# EAGLE schematic VentaConnected_Arduino_V0.01_2017-10-21 (EAGLE 8.3.2)
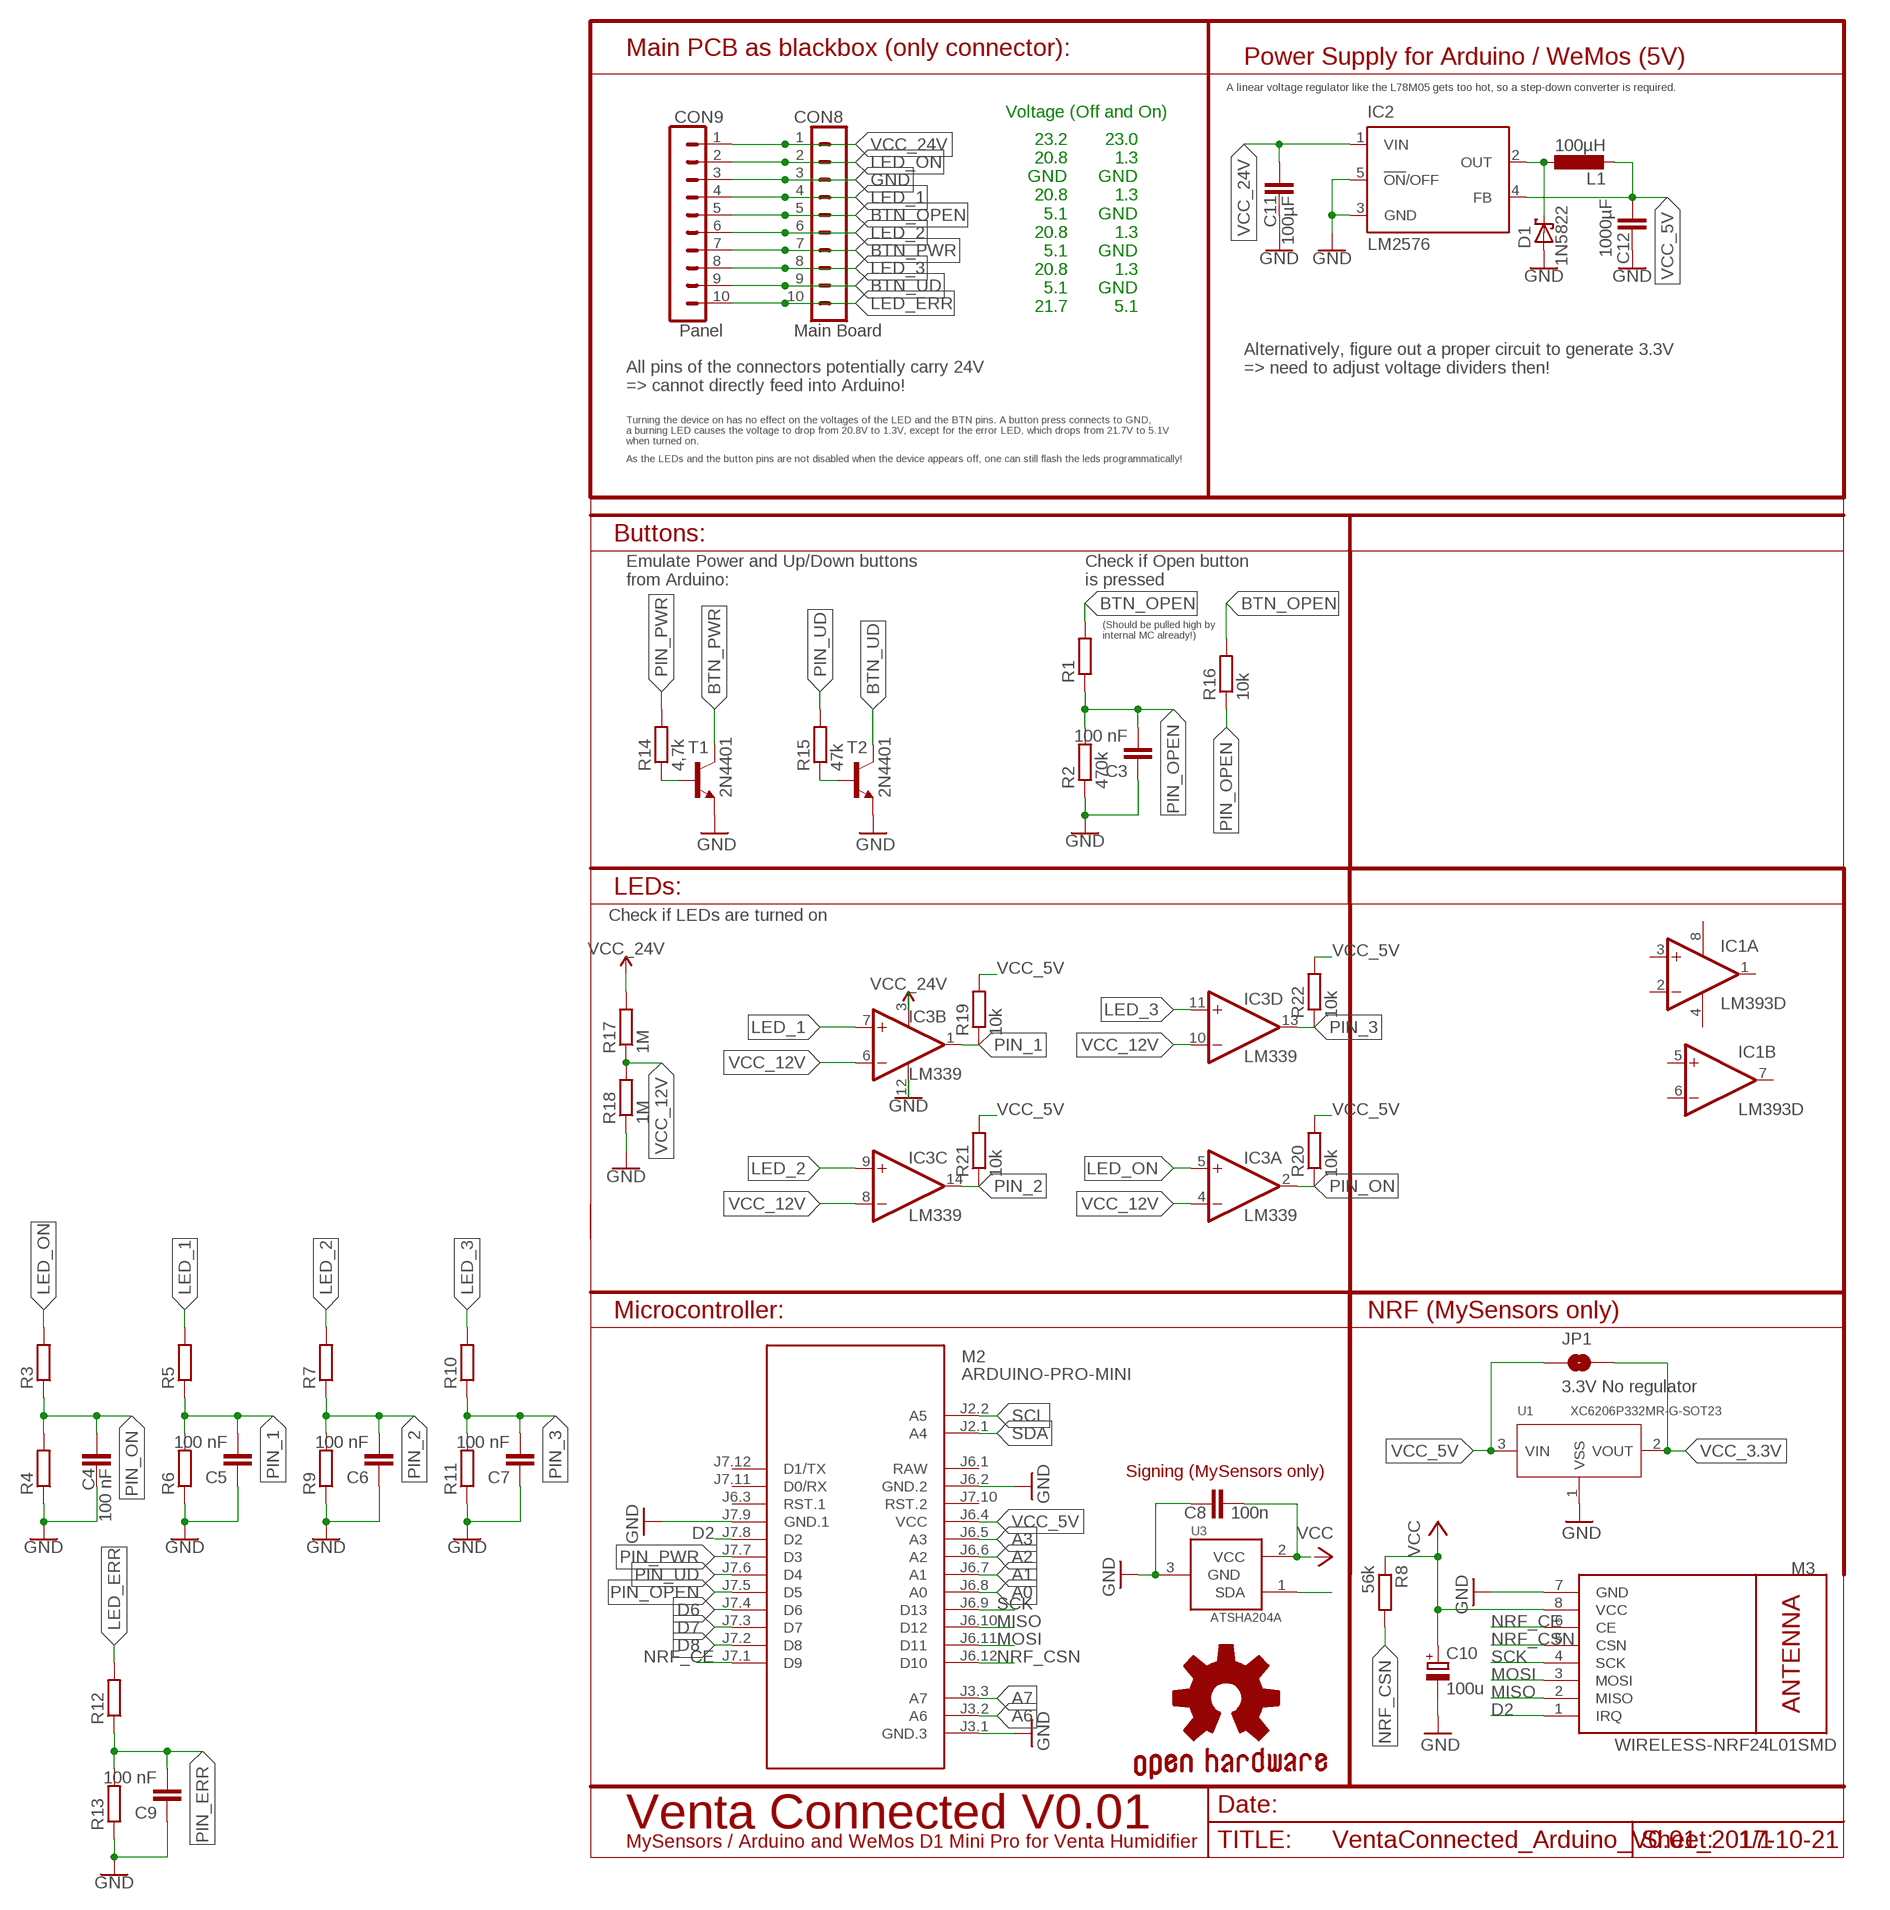
[diagram p0: schematic, sheet 1]

## Parts
C3  100 nF  C-EUC0805  [C0805]
C4  100 nF  C-EUC0805  [C0805]
C5  100 nF  C-EUC0805  [C0805]
C6  100 nF  C-EUC0805  [C0805]
C7  100 nF  C-EUC0805  [C0805]
C8  100n  C-EUC0805  [C0805]
C9  100 nF  C-EUC0805  [C0805]
C10  100u  CPOL-EUUD-5X5,8  [UD-5X5,8_NICHICON]
C11  100µF  C-EUC0805  [C0805]
C12  1000µF  C-EUC0805  [C0805]
CON8  Main Board  CONN_05X2SHD  [2X5-SHROUDED]
CON9  Panel  CONN_05X2SHD  [2X5-SHROUDED]
D1  1N5822  SCHOTTKY-DIODESMD  [SMB]
GOLD_ORB_SM1  OSHWLOGO_GOLD_ORB_SM  [OSHW2]
IC1  LM393D  [SO08]
IC2  LM2576  LM2596S  [TO263-5]
IC3  LM339  TLC339D  [SO14]
JP1  3.3V No regulator  JUMPER-SMT_2_NO_SILK  [SMT-JUMPER_2_NO_SILK]
L1  100µH  L-EUWE-TPC  [POWER-CHOKE_WE-TPC]
M2  ARDUINO-PRO-MINI  ARDUINO-PRO-MINI-3.3V#NP  [ARDUINO-PRO-MINI#NP]
M3  WIRELESS-NRF24L01SMD  [WIRELESS-NRF24L01-SMD]
R1  R-EU_R0805  [R0805]
R2  470k  R-EU_R0805  [R0805]
R3  R-EU_R0805  [R0805]
R4  R-EU_R0805  [R0805]
R5  R-EU_R0805  [R0805]
R6  R-EU_R0805  [R0805]
R7  R-EU_R0805  [R0805]
R8  56k  R-EU_R0805  [R0805]
R9  R-EU_R0805  [R0805]
R10  R-EU_R0805  [R0805]
R11  R-EU_R0805  [R0805]
R12  R-EU_R0805  [R0805]
R13  R-EU_R0805  [R0805]
R14  4,7k  R-EU_R0805  [R0805]
R15  47k  R-EU_R0805  [R0805]
R16  10k  R-EU_R0805  [R0805]
R17  1M  R-EU_R0805  [R0805]
R18  1M  R-EU_R0805  [R0805]
R19  10k  R-EU_R0805  [R0805]
R20  10k  R-EU_R0805  [R0805]
R21  10k  R-EU_R0805  [R0805]
R22  10k  R-EU_R0805  [R0805]
T1  2N4401  MMBT4401LT1-NPN-SOT23-BEC  [SOT23-BEC]
T2  2N4401  MMBT4401LT1-NPN-SOT23-BEC  [SOT23-BEC]
U1  XC6206P332MR-G-SOT23  PMIC-LDO-XC6206P332MR-G(SOT23)  [SOT-23]
U3  ATSHA204A  IC_ATSHA204A_CRYPT  [SOT23-3]

## Nets
A0: M2.J6.8(A0)
A1: M2.J6.7(A1)
A2: M2.J6.6(A2)
A3: M2.J6.5(A3)
A6: M2.J3.2(A6)
A7: M2.J3.3(A7)
BTN_OPEN: CON8.5 CON9.5 R1.2 R16.2
BTN_PWR: CON8.7 CON9.7 T1.C
BTN_UD: CON8.9 CON9.9 T2.C
D2: M2.J7.8(D2) M3.1(IRQ)
D6: M2.J7.4(D6)
D7: M2.J7.3(D7)
D8: M2.J7.2(D8)
GND: C3.1 C4.1 C5.1 C6.1 C7.1 C9.1 C11.2 C12.2 CON8.3 CON9.3 D1.A IC2.3(GND) IC2.5(!ON!/OFF) IC3.12(P:V-) M2.J3.1(GND.3) M2.J6.2(GND.2) M2.J7.9(GND.1) R2.1 R4.1 R6.1 R9.1 R11.1 R13.1 R18.1 T1.E T2.E
GND_ARD: C8.1 C10.- M3.7(GND) U3.3(GND) ; supply symbol labelled GND
LED_1: CON8.4 CON9.4 IC3.7(B:+IN) R5.2
LED_2: CON8.6 CON9.6 IC3.9(C:+IN) R7.2
LED_3: CON8.8 CON9.8 IC3.11(D:+IN) R10.2
LED_ERR: CON8.10 CON9.10 R12.2
LED_ON: CON8.2 CON9.2 IC3.5(A:+IN) R3.2
MISO: M2.J6.10(D12) M3.2(MISO)
MOSI: M2.J6.11(D11) M3.3(MOSI)
N$1: D1.C IC2.2(OUT) L1.1
N$2: R14.1 T1.B
N$3: R15.1 T2.B
NRF_CE: M2.J7.1(D9) M3.6(CE)
NRF_CSN: M2.J6.12(D10) M3.5(CSN) R8.2
PIN_1: C5.2 IC3.1(B:OUT) R5.1 R6.2 R19.1
PIN_2: C6.2 IC3.14(C:OUT) R7.1 R9.2 R21.1
PIN_3: C7.2 IC3.13(D:OUT) R10.1 R11.2 R22.1
PIN_ERR: C9.2 R12.1 R13.2
PIN_ON: C4.2 IC3.2(A:OUT) R3.1 R4.2 R20.1
PIN_OPEN: C3.2 M2.J7.5(D5) R1.1 R2.2 R16.1
PIN_PWR: M2.J7.7(D3) R14.2
PIN_UD: M2.J7.6(D4) R15.2
SCK: M2.J6.9(D13) M3.4(SCK)
SCL: M2.J2.2(A5)
SDA: M2.J2.1(A4) U3.1(SDA)
VCC_3.3V: C10.+ JP1.2 M3.8(VCC) R8.1 U1.2(VOUT) ; supply symbol labelled VCC
VCC_5V: C8.2 C12.1 IC2.4(FB) JP1.1 L1.2 M2.J6.4(VCC) R19.2 R20.2 R21.2 R22.2 U1.3(VIN) U3.2(VCC) ; supply symbol labelled VCC
VCC_12V: IC3.4(A:-IN) IC3.6(B:-IN) IC3.8(C:-IN) IC3.10(D:-IN) R17.1 R18.2
VCC_24V: C11.1 CON8.1 CON9.1 IC2.1(VIN) IC3.3(P:V+) R17.2
VSS: U1.1(VSS) ; supply symbol labelled GND
Unconnected: IC1.1(A:OUT) IC1.2(A:-IN) IC1.3(A:+IN) IC1.5(B:+IN) IC1.6(B:-IN) IC1.7(B:OUT) M2.J6.3(RST.1) M2.J7.10(RST.2) M2.J7.11(D0/RX) M2.J7.12(D1/TX)

## Notes on the sheet
- Main PCB as blackbox (only connector):
- Power Supply for Arduino / WeMos (5V)
- A linear voltage regulator like the L78M05 gets too hot, so a step-down converter is required.
- Voltage (Off and On)
- 23.2
  20.8
  GND
  20.8
  5.1
  20.8
  5.1
  20.8
  5.1
  21.7
- 23.0
  1.3
  GND
  1.3
  GND
  1.3
  GND
  1.3
  GND
  5.1
- Alternatively, figure out a proper circuit to generate 3.3V 
  => need to adjust voltage dividers then!
- All pins of the connectors potentially carry 24V 
  => cannot directly feed into Arduino!
- Turning the device on has no effect on the voltages of the LED and the BTN pins. A button press connects to GND, 
  a burning LED causes the voltage to drop from 20.8V to 1.3V, except for the error LED, which drops from 21.7V to 5.1V 
  when turned on.
- As the LEDs and the button pins are not disabled when the device appears off, one can still flash the leds programmatically!
- Buttons:
- Emulate Power and Up/Down buttons
  from Arduino:
- Check if Open button 
  is pressed
- (Should be pulled high by 
  internal MC already!)
- LEDs:
- Check if LEDs are turned on
- Microcontroller: | NRF (MySensors only)
- Signing (MySensors only)
- Venta Connected V0.01
- MySensors / Arduino and WeMos D1 Mini Pro for Venta Humidifier

## Power pins joined to a net without a drawn wire
RAW: M2.J6.1(RAW)
V+: IC1.8(P:V+)
V-: IC1.4(P:V-)

## Library data of the parts
C3-C7 C9 = resistor:C-EU: CAPACITOR, European symbol
C8 C11 C12 = rcl:C-EU: CAPACITOR, European symbol
C10 = rcl:CPOL-EU: POLARIZED CAPACITOR, European symbol
CON8 CON9 = opentools-connectors:CONN_05X2: Multi connection point. Often used as Generic Header-pin footprint for 0.1 inch spaced/style header connections For AVR SPI programming port, see special device with nice symbol: "AVR_SPI_PROG_5x2.dev" You can populate with any combo of single row headers, but if you'd like an exact match, check these: 2x5 AVR ICSP Male Header <https://www.sparkfun.com/products/778> (PRT-00778) 2x5 Pin Shrouded Header <https://www.sparkfun.com/products/8506> (PRT-08506) On any of the 0.1 inch spaced packages, you can populate with these: Break Away Headers - Straight <https://www.sparkfun.com/products/116> (PRT-00116) Break Away Male Headers - Right Angle <https://www.sparkfun.com/products/553> (PRT-00553) Female Headers <https://www.sparkfun.com/products/115> (PRT-00115) Break Away Headers - Machine Pin <https://www.sparkfun.com/products/117> (PRT-00117) Break Away Female Headers - Swiss Machine Pin <https://www.sparkfun.com/products/743> (PRT-00743) Special note: the shrouded connector mates well with our 5x2 ribbon cables: 2x5 Pin IDC Ribbon Cable <https://www.sparkfun.com/products/8535> (PRT-08535); PROD_ID: CONN-08671; SF_ID: PRT-08506
D1 = diode:SCHOTTKY-DIODE: Schottky Diode
GOLD_ORB_SM1 = bfl:OSHWLOGO: These are Open-Source Hardware logos.
IC1 = linear:LM393: COMPARATOR
IC2 = national-semiconductor:LM2596: SIMPLE SWITCHER® Power Converter 150 kHz 3A Step-Down Voltage Regulator Source: http://www.national.com/ds/LM/LM2596.pdf; MF: NATIONAL SEMICONDUCTOR; MPN: LM2596S-ADJ/NOPB; OC_FARNELL: 9494367; OC_NEWARK: 41K3842
IC3 = linear:TLC339: COMPARATOR
JP1 = SparkFun-Jumpers:JUMPER-SMT_2_NO: Normally open jumper This jumper has two pads in close proximity to each other. Apply solder to close the connection. Round pads are easier to solder for beginners, but are a lot larger. SparkFun Product that uses the round pads: SparkFun EL Sequencer <https://www.sparkfun.com/products/12781>
L1 = rcl:L-EU: INDUCTOR, European symbol
M2 = diy-modules:ARDUINO-PRO-MINI-*#NP: Arduino Pro Mini (and compatible devices) without programming pads More details available here: https://www.arduino.cc/en/Main/ArduinoBoardProMini Click here to find device on ebay.com <http://www.ebay.com/sch/arduino+pro+mini>
M3 = nrf24l01plus:WIRELESS-NRF24L01: 2.4 GHz Wireless Module based on NRF24L01 chip
R1-R7 R9-R18 = resistor:R-EU_: RESISTOR, European symbol
R8 R19-R22 = rcl:R-EU_: RESISTOR, European symbol
T1 T2 = transistor-neu-to92:*-NPN-: NPN Transistror
U1 = Seeed-IC:PMIC-LDO-XC6206P332MR-G(SOT23): 310030099; MPN: XC6206P332MR-G
U3 = TD-MySensors:IC_ATSHA204A_CRYPT